# EAGLE board headstage-64 (EAGLE 9.6.2), part 1 of 2
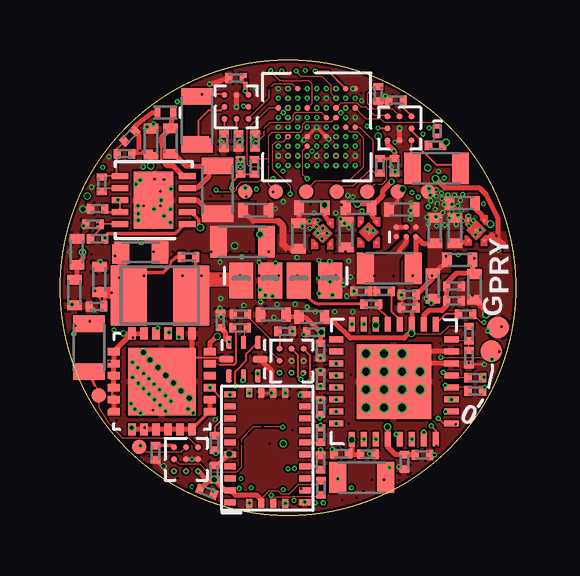
[diagram p5: board, top side]
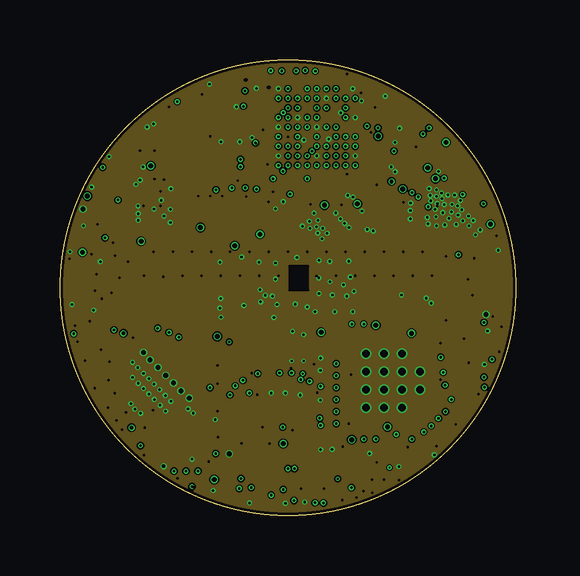
[diagram p6: board, inner layer GND1]
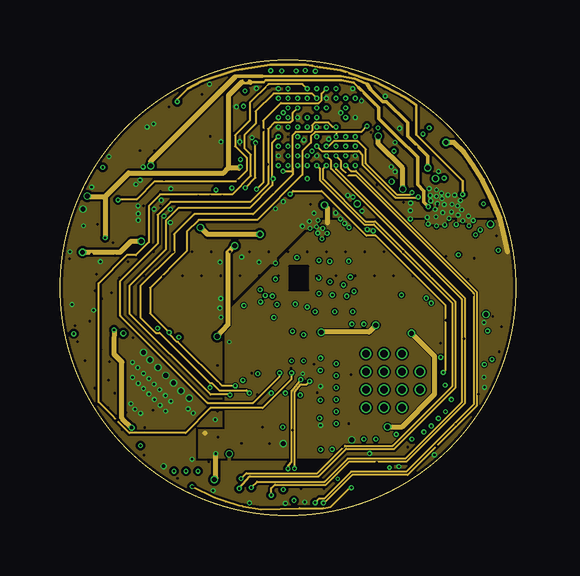
[diagram p7: board, inner layer Route2/PWR]
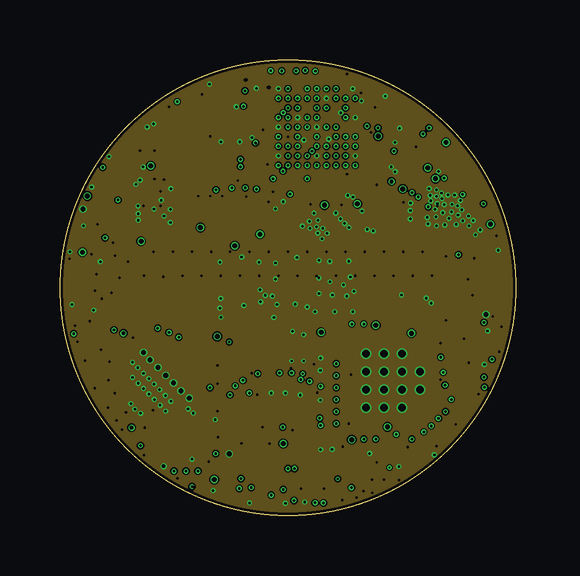
[diagram p8: board, inner layer GND2]
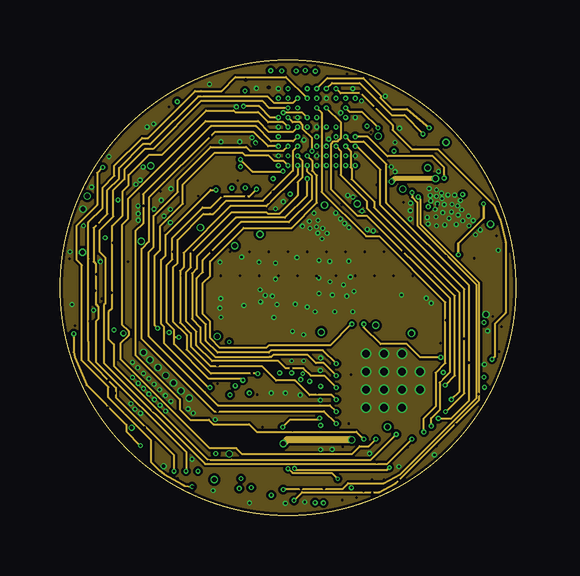
[diagram p9: board, inner layer Route3]
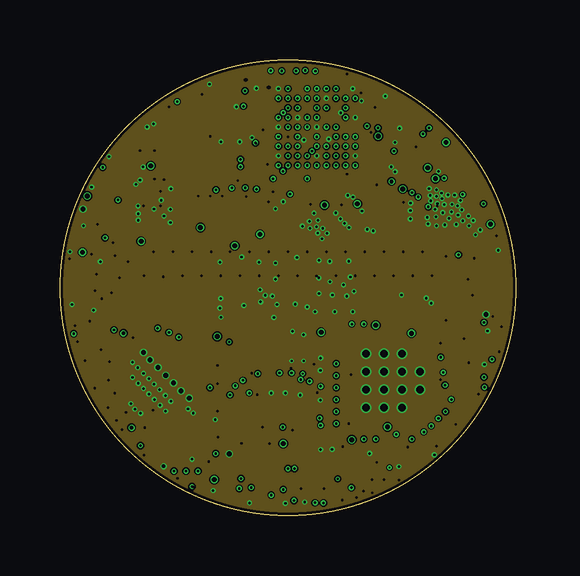
[diagram p10: board, inner layer GND3]
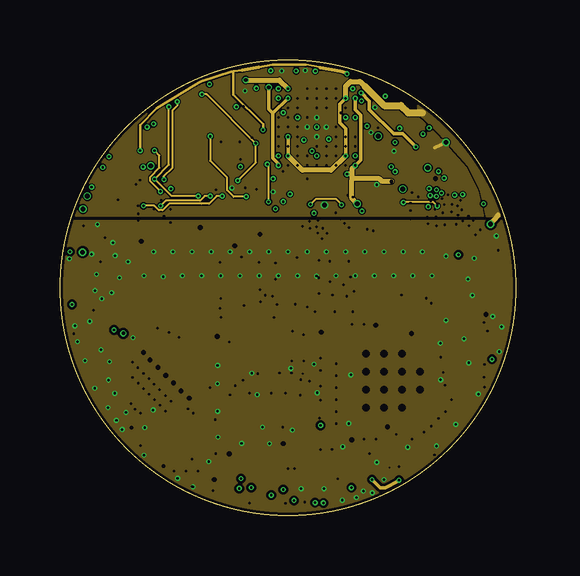
[diagram p11: board, inner layer AGND/PWR]
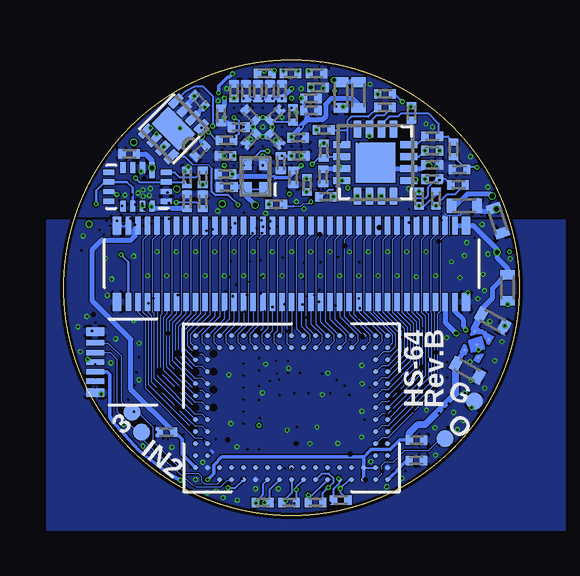
[diagram p12: board, bottom side, seen from below]

Size 19 x 19 mm. Coordinates in mm from the lower left corner, seen from the top.
Outline: circle at 9.5,9.5 radius 9.5
Copper layers ((1*2*3*4*5*6)+(7*16)): Top 0.036mm / dielectric 4mil / GND1 0.036mm / dielectric 5mil / Route2/PWR 0.036mm / dielectric 0.10921875mm / GND2 0.036mm / dielectric 5mil / Route3 0.036mm / dielectric 4mil / GND3 0.035mm / dielectric 0.15mm / AGND/PWR 0.035mm / dielectric 0.2mm / Bottom 0.036mm
Design rules "headstage-256 *": minimum track width 2mil, minimum drill 3mil, track to track 2mil, track to pad 2mil, pad to pad 2mil, via to via 2mil, smd to smd 2mil, copper to edge 5mil, drill to drill 5mil, minimum pad ring 2mil, minimum via ring 2mil, stop-mask expansion 1mil, vias tented up to drill 1mm, thermal gap 4mil
Net classes: 1 thick: width 0.1 mm; 2 diff: width 0.076 mm, drill 0.1 mm, clearance 0.051 mm
tRestrict: area 9.3,9 to 10.6,10.6; 4 lines

## Footprints (pad centres in the part's own frame; a part is rotated, then mirrored left to right if it is on the bottom)
0201T = smd 0.3 x 0.4: 1 -0.3,0; 2 0.3,0
0402T = smd 0.4 x 0.6: 1 -0.533,0; 2 0.533,0
0805PT = smd 0.7 x 1.3: A -1,0; C 1,0
LED-0201T = smd 0.2 x 0.35: 1 -0.2,0; 2 0.2,0
CLP1006-2L = smd 0.24 x 0.49: A -0.325,0; C 0.325,0
HEADSTAGE-64-DAUGHTER-CARD = smd 1 x 1.5: 1 -2.4,-0.1; 2 -1.2,-0.1; 3 0,-0.1; 4 1.3,-0.1
DF40-70HEAD-LESS-SILK = smd 0.23 x 0.75: 1 -6.8,-1.585; 2 -6.4,-1.585; 3 -6,-1.585; 4 -5.6,-1.585; 5 -5.2,-1.585; 6 -4.8,-1.585; 7 -4.4,-1.585; 8 -4,-1.585; 9 -3.6,-1.585; 10 -3.2,-1.585; 11 -2.8,-1.585; 12 -2.4,-1.585; 13 -2,-1.585; 14 -1.6,-1.585; 15 -1.2,-1.585; 16 -0.8,-1.585; 17 -0.4,-1.585; 18 0,-1.585; 19 0.4,-1.585; 20 0.8,-1.585; 21 1.2,-1.585; 22 1.6,-1.585; 23 2,-1.585; 24 2.4,-1.585; 25 2.8,-1.585; 26 3.2,-1.585; 27 3.6,-1.585; 28 4,-1.585; 29 4.4,-1.585; 30 4.8,-1.585; 31 5.2,-1.585; 32 5.6,-1.585; 33 6,-1.585; 34 6.4,-1.585; 35 6.8,-1.585; 36 6.8,1.585; 37 6.4,1.585; 38 6,1.585; 39 5.6,1.585; 40 5.2,1.585; 41 4.8,1.585; 42 4.4,1.585; 43 4,1.585; 44 3.6,1.585; 45 3.2,1.585; 46 2.8,1.585; 47 2.4,1.585; 48 2,1.585; 49 1.6,1.585; 50 1.2,1.585; 51 0.8,1.585; 52 0.4,1.585; 53 0,1.585; 54 -0.4,1.585; 55 -0.8,1.585; 56 -1.2,1.585; 57 -1.6,1.585; 58 -2,1.585; 59 -2.4,1.585; 60 -2.8,1.585; 61 -3.2,1.585; 62 -3.6,1.585; 63 -4,1.585; 64 -4.4,1.585; 65 -4.8,1.585; 66 -5.2,1.585; 67 -5.6,1.585; 68 -6,1.585; 69 -6.4,1.585; 70 -6.8,1.585 | smd 0.35 x 0.75: M1 -7.275,-1.585; M2 7.275,-1.585; M3 7.275,1.585; M4 -7.275,1.585
DF40-10HEAD_HALF = smd 0.23 x 0.75: 1 -0.8,-1.585; 2 -0.4,-1.585; 3 0,-1.585; 4 0.4,-1.585; 5 0.8,-1.585 | smd 0.35 x 0.75: M1 -1.275,-1.585; M2 1.275,-1.585
0603T = smd 0.7 x 0.9: 1 -0.82,0; 2 0.82,0
1210T = smd 1.5 x 2.5: 1 -1.3,0; 2 1.3,0
0805T = smd 0.7 x 1.3: 1 -1,0; 2 1,0
TP07R = smd 0.7 x 0.7: TP 0,0
TP09R = smd 0.9 x 0.9: TP 0,0
TP06R = smd 0.6 x 0.6: TP 0,0
CP_16_27-L = smd 0.711 x 0.305: 1 -1.397,0.75; 2 -1.397,0.25; 3 -1.397,-0.25; 4 -1.397,-0.75; 9 1.397,-0.75; 10 1.397,-0.25; 11 1.397,0.25; 12 1.397,0.75 | smd 0.305 x 0.711: 5 -0.75,-1.397; 6 -0.25,-1.397; 7 0.25,-1.397; 8 0.75,-1.397; 13 0.75,1.397; 14 0.25,1.397; 15 -0.25,1.397; 16 -0.75,1.397 | smd 1.651 x 1.651: PAD 0,0
CP_8_10-L = smd 0.635 x 0.305: 1 -0.889,0.75; 2 -0.889,0.25; 3 -0.889,-0.25; 4 -0.889,-0.75; 5 0.889,-0.75; 6 0.889,-0.25; 7 0.889,0.25; 8 0.889,0.75 | smd 0.991 x 1.6: PAD 0,0
QFN24-4X4 = smd 0.5 x 0.3: 1 -2,1.25; 2 -2,0.75; 3 -2,0.25; 4 -2,-0.25; 5 -2,-0.75; 6 -2,-1.25; 13 2,-1.25; 14 2,-0.75; 15 2,-0.25; 16 2,0.25; 17 2,0.75; 18 2,1.25 | smd 0.3 x 0.5: 7 -1.25,-2; 8 -0.75,-2; 9 -0.25,-2; 10 0.25,-2; 11 0.75,-2; 12 1.25,-2; 19 1.25,2; 20 0.75,2; 21 0.25,2; 22 -0.25,2; 23 -0.75,2; 24 -1.25,2 | smd 2.8 x 2.8: PAD 0,0
UQFN = smd 0.55 x 0.25: 1 -0.7,0.6; 3 -0.7,-0.6; 5 0.7,-0.6; 7 0.7,0.6 | smd 0.55 x 0.2: 2 -0.7,0; 6 0.7,0 | smd 0.3 x 0.6: 4 0,-0.7; 8 0,0.7
MQFN16-1.8X2.6 = smd 0.663 x 0.225: 1 -0.7,0.6 | smd 0.463 x 0.225: 2 -0.8,0.2; 3 -0.8,-0.2; 4 -0.8,-0.6; 9 0.8,-0.6; 10 0.8,-0.2; 11 0.8,0.2; 12 0.8,0.6 | smd 0.225 x 0.463: 5 -0.6,-1.2; 6 -0.2,-1.2; 7 0.2,-1.2; 8 0.6,-1.2; 13 0.6,1.2; 14 0.2,1.2; 15 -0.2,1.2; 16 -0.6,1.2
WLCSP3X3 = smd 0.25 x 0.25: A1 -0.5,0.5; A2 0,0.5; A3 0.5,0.5; B1 -0.5,0; B2 0,0; B3 0.5,0; C1 -0.5,-0.5; C2 0,-0.5; C3 0.5,-0.5
BGA104_0.5MM = smd 0.2 x 0.2: A1 -4,3; A2 -3.5,3; A3 -3,3; A4 -2.5,3; A5 -2,3; A6 -1.5,3; A7 -1,3; A8 -0.5,3; A9 0,3; A10 0.5,3; A11 1,3; A12 1.5,3; A13 2,3; A14 2.5,3; A15 3,3; A16 3.5,3; A17 4,3; B1 -4,2.5; B2 -3.5,2.5; B3 -3,2.5; B4 -2.5,2.5; B5 -2,2.5; B6 -1.5,2.5; B7 -1,2.5; B8 -0.5,2.5; B9 0,2.5; B10 0.5,2.5; B11 1,2.5; B12 1.5,2.5; B13 2,2.5; B14 2.5,2.5; B15 3,2.5; B16 3.5,2.5; B17 4,2.5; C1 -4,2; C2 -3.5,2; C16 3.5,2; C17 4,2; D1 -4,1.5; D2 -3.5,1.5; D16 3.5,1.5; D17 4,1.5; E1 -4,1; E2 -3.5,1; E16 3.5,1; E17 4,1; F1 -4,0.5; F2 -3.5,0.5; F16 3.5,0.5; F17 4,0.5; G1 -4,0; G2 -3.5,0; G16 3.5,0; G17 4,0; H1 -4,-0.5; H2 -3.5,-0.5; H16 3.5,-0.5; H17 4,-0.5; J1 -4,-1; J2 -3.5,-1; J16 3.5,-1; J17 4,-1; K1 -4,-1.5; K2 -3.5,-1.5; K16 3.5,-1.5; K17 4,-1.5; L1 -4,-2; L2 -3.5,-2; L16 3.5,-2; L17 4,-2; M1 -4,-2.5; M2 -3.5,-2.5; M3 -3,-2.5; M4 -2.5,-2.5; M5 -2,-2.5; M6 -1.5,-2.5; M7 -1,-2.5; M8 -0.5,-2.5; M9 0,-2.5; M10 0.5,-2.5; M11 1,-2.5; M12 1.5,-2.5; M13 2,-2.5; M14 2.5,-2.5; M15 3,-2.5; M16 3.5,-2.5; M17 4,-2.5; N1 -4,-3; N2 -3.5,-3; N3 -3,-3; N4 -2.5,-3; N5 -2,-3; N6 -1.5,-3; N7 -1,-3; N8 -0.5,-3; N9 0,-3; N10 0.5,-3; N11 1,-3; N12 1.5,-3; N13 2,-3; N14 2.5,-3; N15 3,-3; N16 3.5,-3; N17 4,-3
WQFN32-5X5 = smd 0.25 x 0.6: 1 1.75,2.4; 2 1.25,2.4; 3 0.75,2.4; 4 0.25,2.4; 5 -0.25,2.4; 6 -0.75,2.4; 7 -1.25,2.4; 8 -1.75,2.4; 17 -1.75,-2.4; 18 -1.25,-2.4; 19 -0.75,-2.4; 20 -0.25,-2.4; 21 0.25,-2.4; 22 0.75,-2.4; 23 1.25,-2.4; 24 1.75,-2.4 | smd 0.6 x 0.25: 9 -2.4,1.75; 10 -2.4,1.25; 11 -2.4,0.75; 12 -2.4,0.25; 13 -2.4,-0.25; 14 -2.4,-0.75; 15 -2.4,-1.25; 16 -2.4,-1.75; 25 2.4,-1.75; 26 2.4,-1.25; 27 2.4,-0.75; 28 2.4,-0.25; 29 2.4,0.25; 30 2.4,0.75; 31 2.4,1.25; 32 2.4,1.75 | smd 3.1 x 3.1: PAD 0,0
LGA-28-3.8X5.2 = smd 0.25 x 0.475: 1 -2.25,1.56; 6 -2.25,-1.56; 7 -1.75,-1.56; 8 -1.25,-1.56; 9 -0.75,-1.56; 10 -0.25,-1.56; 11 0.25,-1.56; 12 0.75,-1.56; 13 1.25,-1.56; 14 1.75,-1.56; 15 2.25,-1.56; 20 2.25,1.56; 21 1.75,1.56; 22 1.25,1.56; 23 0.75,1.56; 24 0.25,1.56; 25 -0.25,1.56; 26 -0.75,1.56; 27 -1.25,1.56; 28 -1.75,1.56 | smd 0.375 x 0.25: 2 -2.3,0.75; 3 -2.3,0.25; 4 -2.3,-0.25; 5 -2.3,-0.75; 16 2.3,-0.75; 17 2.3,-0.25; 18 2.3,0.25; 19 2.3,0.75
X2SON = smd 0.1 x 0.1: 1 -0.43,0.33; 2 -0.43,-0.33; 3 0.43,-0.33; 4 0.43,0.33 | smd 0.1 x 0.1 rotated 45: PAD 0,0
VBGA81-4X4 = smd 0.23 x 0.23: A1 1.6,1.6; A2 1.2,1.6; A3 0.8,1.6; A4 0.4,1.6; A5 0,1.6; A6 -0.4,1.6; A7 -0.8,1.6; A8 -1.2,1.6; A9 -1.6,1.6; B1 1.6,1.2; B2 1.2,1.2; B3 0.8,1.2; B4 0.4,1.2; B5 0,1.2; B6 -0.4,1.2; B7 -0.8,1.2; B8 -1.2,1.2; B9 -1.6,1.2; C1 1.6,0.8; C2 1.2,0.8; C3 0.8,0.8; C4 0.4,0.8; C5 0,0.8; C6 -0.4,0.8; C7 -0.8,0.8; C8 -1.2,0.8; C9 -1.6,0.8; D1 1.6,0.4; D2 1.2,0.4; D3 0.8,0.4; D4 0.4,0.4; D5 0,0.4; D6 -0.4,0.4; D7 -0.8,0.4; D8 -1.2,0.4; D9 -1.6,0.4; E1 1.6,0; E2 1.2,0; E3 0.8,0; E4 0.4,0; E5 0,0; E6 -0.4,0; E7 -0.8,0; E8 -1.2,0; E9 -1.6,0; F1 1.6,-0.4; F2 1.2,-0.4; F3 0.8,-0.4; F4 0.4,-0.4; F5 0,-0.4; F6 -0.4,-0.4; F7 -0.8,-0.4; F8 -1.2,-0.4; F9 -1.6,-0.4; G1 1.6,-0.8; G2 1.2,-0.8; G3 0.8,-0.8; G4 0.4,-0.8; G5 0,-0.8; G6 -0.4,-0.8; G7 -0.8,-0.8; G8 -1.2,-0.8; G9 -1.6,-0.8; H1 1.6,-1.2; H2 1.2,-1.2; H3 0.8,-1.2; H4 0.4,-1.2; H5 0,-1.2; H6 -0.4,-1.2; H7 -0.8,-1.2; H8 -1.2,-1.2; H9 -1.6,-1.2; J1 1.6,-1.6; J2 1.2,-1.6; J3 0.8,-1.6; J4 0.4,-1.6; J5 0,-1.6; J6 -0.4,-1.6; J7 -0.8,-1.6; J8 -1.2,-1.6; J9 -1.6,-1.6
DFN103X3 = smd 0.7 x 0.25: 1 -1.4,1; 2 -1.4,0.5; 3 -1.4,0; 4 -1.4,-0.5; 5 -1.4,-1; 6 1.4,-1; 7 1.4,-0.5; 8 1.4,0; 9 1.4,0.5; 10 1.4,1 | smd 1.65 x 2.38: PAD 0,0
XBGA6_1.2X0.8 = smd 0.23 x 0.23: A1 0.2,-0.4; A2 -0.2,-0.4; B1 0.2,0; B2 -0.2,0; C1 0.2,0.4; C2 -0.2,0.4
ASCO = smd 0.6 x 0.5: 1 -0.55,-0.4; 2 0.55,-0.4; 3 0.55,0.4; 4 -0.55,0.4

## Placement (x,y rotation side)
C1  0.1uF  [0201T]  8.18,14.14 270 bottom
C2  0.1uF  [0201T]  13.3,15.2 225 bottom
C3  0.1uF  [0201T]  13.34,17.3 135 bottom
C4  0.1uF  [0201T]  3.64,14.62 0 bottom
C5  0.1uF  [0201T]  6.68,8.14 90 top
C6  0.1uF  [0201T]  1.52,8.72 180 top
C7  4.7uF  [0402T]  1.64,9.84 90 top
C8  0.1uF  [0201T]  13.85,13.1 90 bottom
C9  0.1uF  [0201T]  16.27,15.08 180 bottom
C10  10nF  [0201T]  16.42,8.96 0 top
C11  0.1uF  [0201T]  16.42,9.57 0 top
C12  4.7uF  [0402T]  17.27,9.54 270 top
C13  0.1uF  [0201T]  15.1,2.53 0 top
C14  10nF  [0201T]  14.35,2.24 270 top
C15  10nF  [0201T]  14.53,8.66 180 top
C16  0.1uF  [0201T]  14.53,9.22 180 top
C17  4.7uF  [0402T]  15.53,9.57 270 top
C18  0.1uF  [0201T]  10.86,5.69 90 top
C19  1uF  [0201T]  9.38,7.68 0 top
C20  0.1uF  [0201T]  12.83,2.56 0 top
C21  10nF  [0201T]  11.72,2.58 180 top
C22  10nF  [0201T]  10.58,7.65 180 top
C23  0.1uF  [0201T]  10.86,6.88 270 top
C24  15uF  [0402T]  8.89,8.38 180 top
C25  0.1uF  [0201T]  12.97,8.82 0 top
C26  47nF  [0201T]  13.5,9.35 0 top
C27  0.1uF  [0201T]  13.94,14.58 270 top
C28  1uF  [0201T]  14,17.32 180 top
C29  10nF  [0201T]  4.3,2.3 0 bottom
C30  0.1uF  [0201T]  4.29,3.15 180 bottom
C31  0.1uF  [0201T]  6.43,1.8 90 top
C32  0.1uF  [0201T]  7.33,18.24 180 top
C33  0.1uF  [0201T]  10.86,2.22 270 top
C34  1uF  [0201T]  6.83,15.62 270 top
C35  0.1uF  [0201T]  6.12,1 340 top
C36  1uF  [0201T]  3.98,2.62 270 top
C37  10uF  [0402T]  1.12,8.13 330.9 bottom
C38  10uF  [0402T]  2.19,6.06 330.9 bottom
C39  10uF  [0402T]  9.94,11.66 90 top
C40  10uF  [0402T]  10.5,12.83 180 top
C41  10uF  [0402T]  8.16,12.73 0 top
C42  0.22uF  [0402T]  2.3,12.92 0 bottom
C43  2.2nF  [0201T]  9.2,15 0 bottom
C44  4.7nF  [0201T]  12.25,15 180 bottom
C45  10nF  [0201T]  11.9,17.7 90 bottom
C46  22nF  [0201T]  8.7,17.4 0 bottom
C47  47nF  [0201T]  8.7,16.9 0 bottom
C48  0.1uF  [0201T]  9.95,14.7 270 bottom
C49  1uF  [0201T]  9.23,15.76 0 bottom
C50  4.7nF  [0201T]  9.9,17.7 90 bottom
C51  10nF  [0201T]  10.4,17.7 90 bottom
C52  22nF  [0201T]  10.9,17.7 90 bottom
C53  0.47uF  [0201T]  11.4,17.7 90 bottom
C54  10uF  [0402T]  7.44,17.54 270 bottom
C55  10uF  [0402T]  11.92,11.72 90 top
C56  10uF  [0402T]  12.44,12.83 180 top
C57  10pF  [0201T]  2.9,15.83 45 top
C58  4.7nF  [0201T]  10.2,16.7 45 bottom
C59  10nF  [0201T]  10.2,15.7 315 bottom
C60  22nF  [0201T]  11.18,15.7 225 bottom
C61  47nF  [0201T]  11.2,16.7 135 bottom
C62  0.47uF  [0201T]  11.7,16.2 180 bottom
C63  1uF  [0402T]  4.61,15.62 90 top
C64  0.22uF  [0402T]  3.79,15.6 90 top
C65  4.7nF  [0201T]  9.43,14.1 270 bottom
C66  10nF  [0201T]  12.25,14.24 180 bottom
C67  22nF  [0201T]  8.4,17.86 0 bottom
C68  0.47uF  [0201T]  12.44,16.68 270 bottom
C69  10uF  [0402T]  14.24,12.76 0 top
C70  4.7uF  [0402T]  15.62,11.88 90 top
C71  10nF  [0201T]  12.2,13.7 180 bottom
C72  1uF  [0402T]  16.46,11.88 90 top
C73  15uF  [0402T]  16.76,13.03 180 top
C74  10uF  [0402T]  0.7,11 90 top
C75  10uF  [0402T]  0.6,9.3 270 top
C77  10uF  [0402T]  0.5,9.5 270 bottom
D4  VEMD1160X01  [0805PT]  12.57,1.59 0 top
D5  VEMD1160X01  [0805PT]  15.69,14.48 180 top
D6  VEMD1160X01  [0805PT]  5.71,16.48 90 top
D7  XZVGR155W  [LED-0201T]  15.72,16.03 270 top
D8  VEMD1160X01  [0805PT]  1.21,7 270 top
D9  VSKY05401006  [CLP1006-2L]  4.39,16.8 0 top
J5  [HEADSTAGE-64-DAUGHTER-CARD]  9.95,9.9 0 top
J8  DF40C-70DP-0.4V(51)  [DF40-70HEAD-LESS-SILK]  9.5,10.5 0 bottom
J9  [DF40-10HEAD_HALF]  16.1,6.4 270 bottom
L2  BLM18KG601SN1D  [0603T]  3.35,10.97 0 top
L4  CBC3225T101MR  [1210T]  4.16,9.18 180 top
L6  BLM15PX601SN1D  [0402T]  16.66,10.66 0 top
L7  BLM15PX601SN1D  [0402T]  0.9,12.3 287.8 bottom
L8  BLM15PX601SN1D  [0402T]  10.49,8.28 180 top
L9  MLZ2012M100WT000  [0805T]  7.6,11.42 180 top
L10  BLM15PX601SN1D  [0402T]  6.72,17.54 90 bottom
L11  MLZ2012M100WT000  [0805T]  6.56,13.58 270 top
L12  LQM21PN1R0NGRD  [0805T]  13.72,10.31 180 top
R1  9k, 0.1%  [0201T]  8.16,15.22 90 bottom
R2  1k, 0.1%  [0201T]  8.06,13.3 180 bottom
R4  10k, 0.1%  [0201T]  10.14,12.98 0 bottom
R5  10k, 0.1%  [0201T]  8.16,16.08 0 bottom
R6  10k, 0.1%  [0201T]  4.51,16.79 90 bottom
R7  10k, 0.1%  [0201T]  3.64,15.81 180 bottom
R8  10k, 0.1%  [0201T]  3.64,14.03 180 bottom
R10  1k  [0201T]  5.36,10.78 180 top
R11  10k, 0.1%  [0201T]  5.61,17.02 0 bottom
R12  100  [0201T]  5.61,17.58 180 bottom
R13  2.86k  [0201T]  2.56,13.8 180 bottom
R14  10k, 0.1%  [0201T]  2.75,15.27 90 bottom
R15  590  [0201T]  7.5,7.83 0 top
R16  10k, 0.1%  [0201T]  3.48,13.22 270 bottom
R17  10k, 0.1%  [0201T]  4.19,13.22 270 bottom
R18  10k, 0.1%  [0201T]  3.64,15.22 180 bottom
R19  10k, 0.1%  [0201T]  2.5,14.43 0 bottom
R21  1k  [0201T]  13.2,13.1 270 bottom
R22  10k  [0201T]  13.2,14.1 90 bottom
R23  10k  [0201T]  13.85,14.11 90 bottom
R24  15k  [0201T]  7.52,8.4 0 top
R25  49.9  [0201T]  12.55,9.35 0 top
R26  15k  [0201T]  13.26,17.58 90 top
R27  10k  [0201T]  17.04,7.59 270 top
R28  10k  [0201T]  10.87,1.16 270 top
R29  0  [0201T]  14.71,3.48 0 bottom
R30  100k  [0201T]  17.04,6.59 270 top
R31  100  [0201T]  10.7,0.55 0 bottom
R32  10k  [0201T]  10.86,3.36 90 top
R33  10k  [0201T]  16.9,8.4 180 top
R34  100  [0201T]  9.6,0.55 0 bottom
R35  100  [0201T]  8.5,0.55 180 bottom
R36  15k  [0201T]  7.44,15.62 90 top
R37  2k  [0201T]  15.65,15.44 180 top
R38  10k  [0201T]  12.22,15.64 0 bottom
R39  10k  [0201T]  8.1,14.54 90 top
R40  10k  [0201T]  13.33,14.58 270 top
R41  4.7k  [0201T]  7.52,14.55 270 top
R42  15k  [0201T]  10.86,4.52 270 top
R43  1k  [0201T]  8.12,15.62 90 top
R44  4.7k  [0201T]  17.3,5.2 180 top
R45  1M  [0201T]  1.57,11.54 0 top
R46  90.9k  [0201T]  1.37,12.14 0 top
R47  100  [0201T]  7.45,0.65 0 bottom
R48  83.3k  [0201T]  1.74,13.82 270 top
R49  10k  [0201T]  1.57,12.8 180 top
R50  1M  [0201T]  2.69,15.09 180 top
R51  4.7k  [0201T]  8.85,13.8 270 bottom
R52  4.7k  [0201T]  17.3,5.75 180 top
R53  10k  [0201T]  6.44,3.03 90 top
R54  10k  [0201T]  9.44,16.71 90 bottom
R55  10k  [0201T]  9.54,18.44 180 bottom
R56  10k  [0201T]  10.62,18.44 180 bottom
R57  10k  [0201T]  8.46,18.44 0 bottom
TP1  VCC  [TP07R]  1.88,4.77 0 bottom
TP2  VCC  [TP07R]  3.1,3.2 0 bottom
TP3  [TP09R]  18.25,7.85 0 top
TP4  [TP09R]  17.98,6.85 0 top
TP5  VCC  [TP07R]  16.15,4.31 0 bottom
TP6  VCC  [TP07R]  15.76,3.49 0 bottom
TP7  [TP06R]  1.62,5.02 0 top
TP8  [TP06R]  3.3,2.86 0 top
TP9  [TP06R]  14.07,13.51 0 top
TP10  [TP06R]  8.99,13.51 270 top
TP11  [TP06R]  7.72,13.51 270 top
TP12  [TP06R]  11.53,13.51 270 top
TP13  [TP06R]  10.26,13.51 270 top
TP14  gnd  [TP06R]  12.8,13.51 270 top
TP15  VCC  [TP06R]  15.34,13.51 270 top
U1  ADA4062-4ACPZ-R7  [CP_16_27-L]  6.01,14.72 0 bottom
U2  AD5681RBCPZ-1RL7  [CP_8_10-L]  14.42,16.13 225 bottom
U3  CAT4016_QFN  [QFN24-4X4]  4.25,5.59 270 top
U4  TPL0501_UQFN  [UQFN]  7.64,6.52 90 top
U5  DG509B  [MQFN16-1.8X2.6]  15.92,13.71 270 bottom
U6  TS4231  [WLCSP3X3]  9.65,6.45 0 top
U7  RHD2064_BGA  [BGA104_0.5MM]  9.5,4.5 0 bottom
U8  TS4231  [WLCSP3X3]  14.15,16.15 270 top
U9  [WQFN32-5X5]  13.91,5.59 270 top
U10  BNO055  [LGA-28-3.8X5.2]  8.64,2.81 90 top
U11  TS4231  [WLCSP3X3]  7.35,17.05 90 top
U12  TS4231  [WLCSP3X3]  5.25,2.35 0 top
U13  TLV70733  [X2SON]  1.79,7.13 60.9 bottom
U14  10M08DC  [VBGA81-4X4]  10.7,16.2 0 top
U15  TLV70733  [X2SON]  10.94,11.76 270 top
U16  LT3463  [DFN103X3]  3.9,13.16 180 top
U17  TLV70725  [X2SON]  12.86,11.82 270 top
U18  TPS62621  [XBGA6_1.2X0.8]  14.42,11.84 270 top
U19  ASCO-50.000MHZ-EK-T3  [ASCO]  11,14.15 90 bottom
U20  TLV70712  [X2SON]  17.34,11.9 270 top